# EasyEDA Pro project FSS1500-HAND.eprj

# Schematic Schematic1
Create Date: 2022-12-30; Page Name: P1; Project Name: FSS1500-HAND; Schematic Name: Schematic1; Update Date: 2023-03-24
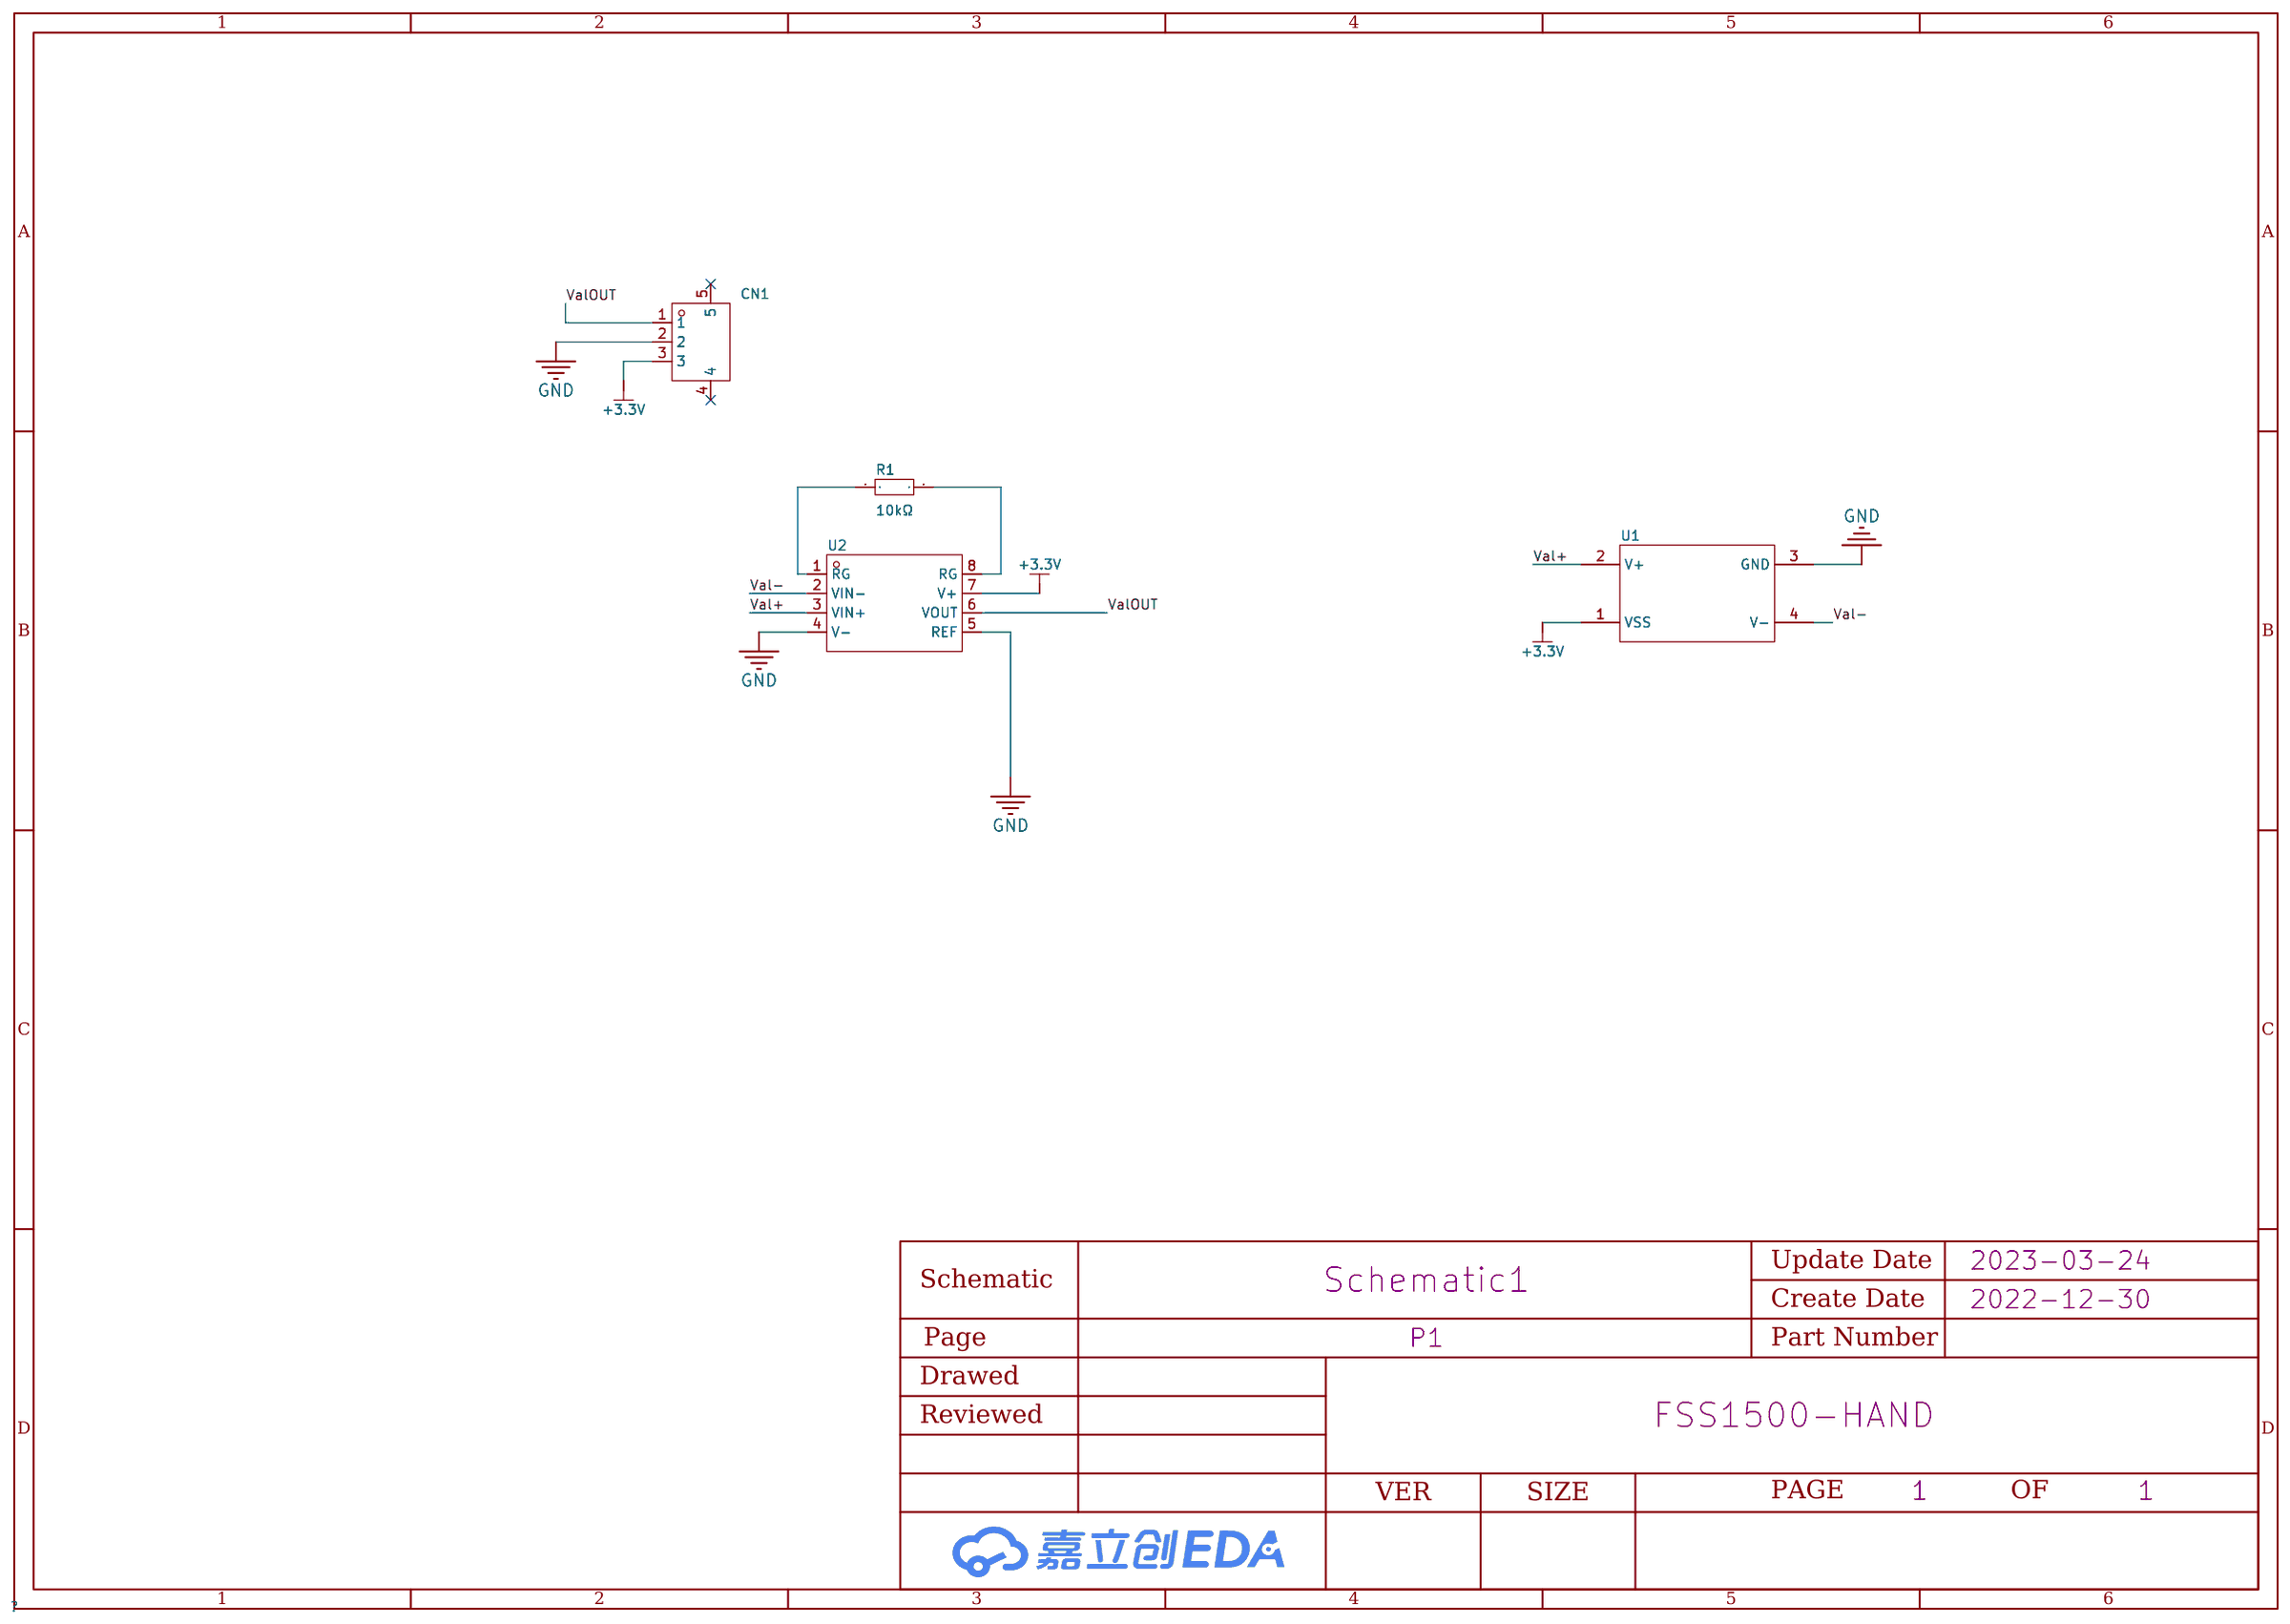
[diagram p0: schematic sheet]

## Parts
CN1  ZH-3PWB  [CONN-SMD_3P-P1.50_DEALON_ZH-3PWB]
R1  10kΩ  [R0603]
U1  -  [FSS1500NST]
U2  INA333AIDGKR  [MSOP-8_L3.0-W3.0-P0.65-LS5.0-BL]

## Library data of the parts
CN1 = ZH-3PWB: 参考系列:ZH;间距:1.5mm;插针结构:1x3P;排数:1;每排PIN数:3;行距:-;公母:公型插针;安装方式:卧贴;额定电流:1A;工作温度范围:-25~+85;; LCSC Part Name: ZH 1.5mm 1x3P 卧贴; Supplier Part: C2905015; Manufacturer: DEALON(德艺隆); Supplier Footprint: SMD,P=1.5mm; JLCPCB Part Class: Extended Part; Datasheet: https://atta.szlcsc.com/upload/public/pdf/source/20211025/0472E62A90AA7D6E290CF88C78AD145A.pdf; Supplier: LCSC; Reference Series: ZH; Pitch: 1.5mm; Pins Structure: 1x3P; Number of Rows: 1; Number of PINs Per Row: 3; Gender: 公型插针; Mounting Style: 卧贴; Current Rating (Max): 1A; Operating Temperature Range: -25~+85
R1 = CR0603JA0103G: 电阻类型:厚膜电阻;阻值:10kΩ;精度:±5%;功率:1/10W;温度系数:±200ppm/;最大工作电压:50V;工作温度范围:-55~+125;; LCSC Part Name: 10kΩ ±5%; Supplier Part: C101254; Manufacturer: LIZ(丽智电子); Supplier Footprint: 0603; JLCPCB Part Class: Extended Part; Datasheet: https://atta.szlcsc.com/upload/public/pdf/source/20170408/1491631441449.pdf; Supplier: LCSC; Type: 厚膜电阻; Tolerance: ±5%; Power(Watts): 1/10W; Temperature Coefficient: ±200ppm/; Overload Voltage (Max): 50V; Operating Temperature Range: -55~+125
U1 = FSS1500
U2 = INA333AIDGKR: 运放类型:Instrumentation;放大器组数:1;增益带宽积（GBP）:-;压摆率（SR）:0.16 V/us;电源电压:1.8V ~ 5.5V, ±0.9V ~ 2.75V;各通道供电电流:75uA;; Supplier Part: C19450; Manufacturer: TI(德州仪器); Supplier Footprint: VSSOP-8; JLCPCB Part Class: Extended Part; Datasheet: https://atta.szlcsc.com/upload/public/pdf/source/20130925/1457706651096.pdf; Supplier: LCSC; Amplifier Type: Instrumentation; Number of Circuits: 1; Slew Rate（SR）: 0.16 V/us; Output Type: Rail-to-Rail; Supply Voltage（Single）: 1.8V ~ 5.5V, ±0.9V ~ 2.75V; Iq per channel (Typ): 75uA; Operating Temperature: -40°C ~ 125°C

## Nets
+3.3V: CN1.3 U1.1(VSS) U2.7(V+)
GND: CN1.2 U1.3(GND) U2.4(V-) U2.5(REF)
Val+: U1.2(V+) U2.3(VIN+)
Val-: U1.4(V-) U2.2(VIN-)
ValOUT: CN1.1 U2.6(VOUT)
$1N427: R1.1 U2.1(RG)
$1N434: R1.2 U2.8(RG)

Not connected (* = marked no-connect by the designer): CN1 4* 5*

# Board PCB1
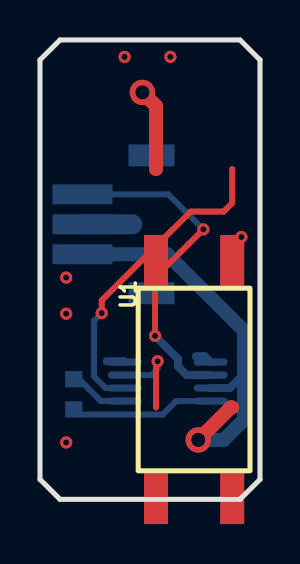
[diagram p1: board, top side]
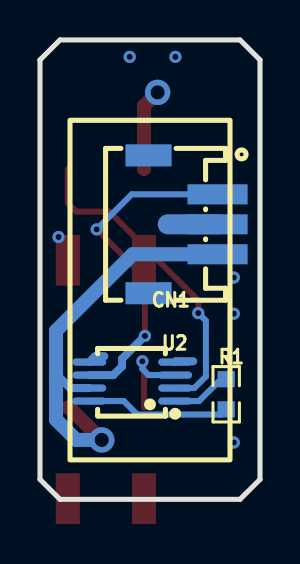
[diagram p2: board, bottom side, seen from below]

Outline 11 x 23 mm; copper layers: Top Layer, Bottom Layer. Coordinates in mm from the lower left corner of the outline.
Outline path: 0,22 0,1 1,0 10,0 11,1 11,22 10,23 1,23 0,22
Stack: Top Layer 0.035mm / Dielectric1 1.51mm FR4 er 4.5 / Bottom Layer 0.035mm

## Design rules (mm)
spacing safeClearance (default): track to track 0.152, other pairs 0.152 to 0.3
track width trackWidth (default): min 0.127, default 0.254, max 2.54
differential pair differentialPair (default): width min 0.127, default 0.254, max 2.54; gap min 0.152, default 0.152
via viaSize (default): diameter min 0.5, default 0.61, max 10; hole min 0.3, default 0.305, max 6

## Placement (name value [footprint] x y rotation side)
CN1  ZH-3PWB  [CONN-SMD_3P-P1.50_DEALON_ZH-3PWB]  3.85 13.77 270 bottom
R1  10kΩ  [R0603]  1.69 5.26 270 bottom
U1  -  [FSS1500NST]  7.71 6 90 top
U2  INA333AIDGKR  [MSOP-8_L3.0-W3.0-P0.65-LS5.0-BL]  6.39 5.9 90 bottom

## Footprints (pads in the part's own frame, mm; a bottom-side part is the same pattern mirrored in y, then rotated)
CONN-SMD_3P-P1.50_DEALON_ZH-3PWB
  rect 1x3 smd: 1(-1.5,1.725) 2(0,1.725) 3(1.5,1.725)
  rect 1.1x2.3 smd: 4(-3.45,-1.725) 5(3.45,-1.725)
FSS1500NST
  rect 2.54x1.2 smd: 1(-5.967,-1.905) 2(-5.967,1.905) 3(5.967,1.905) 4(5.967,-1.905)
MSOP-8_L3.0-W3.0-P0.65-LS5.0-BL
  oval 0.363x1.692 smd: 1(-0.976,-2.147) 2(-0.325,-2.147) 3(0.325,-2.147) 4(0.976,-2.147) 5(0.976,2.147) 6(0.325,2.147) 7(-0.325,2.147) 8(-0.976,2.147)
R0603
  rect 0.807x0.864 smd: 1(-0.754,0) 2(0.754,0)

## Nets
+3.3V: CN1.3 U1.1 U2.7
GND: CN1.2 U1.3 U2.4 U2.5
VAL+: U1.2 U2.3
VAL-: U1.4 U2.2
VALOUT: CN1.1 U2.6
$1N427: R1.1 U2.1
$1N434: R1.2 U2.8

Pads without a net: CN1 4 5

## Via types
v1: diameter 0.61, hole 0.305, Top Layer to Bottom Layer, 10 vias
v2: diameter 1.27, hole 0.711, Top Layer to Bottom Layer, 2 vias

## Routing (per net, layer and track width the routed paths; a pad name or vN(x,y) marks a point on that pad's centre or on a via; arc(x,y) is an arc through that point)
+3.3V: length 21
  Top Layer w0.7: v2(7.91,2.97) 9.54,4.6 9.61,4.6
  Bottom Layer w0.4: U2.7 9.49,5.57 9.94,6.02 10.2,6.02
  Bottom Layer w0.7: v2(7.91,2.97) 9.18,2.97 10.2,3.99 10.2,5.06 ; 10.2,5.13 10.2,8.44 6.37,12.27 CN1.3
GND: length 8.4
  Top Layer w0.7: 5.8,16.54 5.8,19.69 v2(5.12,20.37)
  Bottom Layer w0.4: 7.79,7.17 8.24,7.17 U2.5 ; U2.4 4.2,6.91 3.34,6.91
  Bottom Layer w1: CN1.2 4.61,13.77
  vias: v1(1.31,11.1) v1(1.31,9.29) v1(1.31,2.85) v1(4.23,22.15) v1(6.52,22.15) v1(10.07,13.14)
VAL+: length 4.5
  Top Layer w0.3: 5.8,4.6 5.8,6.83 v1(5.88,6.91)
  Bottom Layer w0.3: v1(5.88,6.91) 5.88,6.53 5.57,6.22 U2.3
VAL-: length 16
  Top Layer w0.3: v1(3.09,9.33) 3.09,9.96 7.53,14.41 9.18,14.41 9.61,14.83 9.61,16.54
  Bottom Layer w0.3: v1(3.09,9.33) 2.71,8.94 2.71,6.15 3.28,5.57 U2.2
VALOUT: length 16.9
  Top Layer w0.3: v1(5.75,8.18) 5.75,11.1 v1(8.17,13.52)
  Bottom Layer w0.3: CN1.1 6.41,15.27 v1(8.17,13.52)
  Bottom Layer w0.4: v1(5.75,8.18) 6.9,7.04 6.9,6.66 7.33,6.22 U2.6
$1N427: length 3
  Bottom Layer w0.3: U2.1 3.05,4.92 1.95,6.02 R1.1
$1N434: length 7.2
  Bottom Layer w0.3: U2.8 6.81,4.92 6.13,4.25 1.95,4.25 R1.2

## Copper pours and planes (outline as drawn; the poured copper is in the pictures)
GND on Top Layer: -1.23,23.93 11.98,23.93 11.98,-1.47 -1.23,-1.47
GND on Bottom Layer: -1.23,23.93 11.98,23.93 11.98,-1.47 -1.23,-1.47
